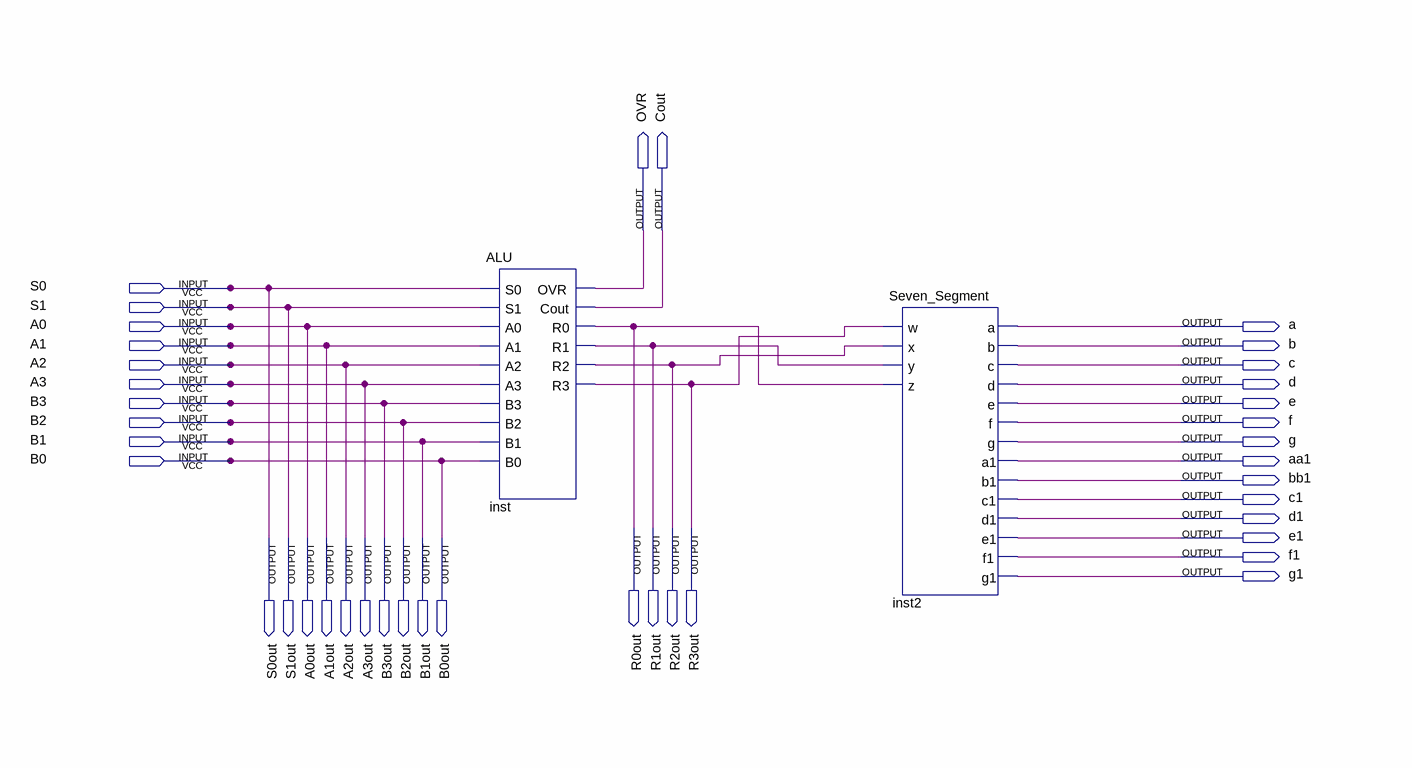
[diagram p0: schematic sheet]
// Quartus schematic Lab7_ALU.bdf as structural Verilog: 2 symbols, 40 pins
module Lab7_ALU (
  input  S0,
  input  S1,
  input  A0,
  input  A1,
  input  A2,
  input  A3,
  input  B3,
  input  B2,
  input  B1,
  input  B0,
  output OVR,
  output Cout,
  output a,
  output b,
  output c,
  output d,
  output e,
  output f,
  output g,
  output aa1,
  output bb1,
  output c1,
  output d1,
  output R0out,
  output R1out,
  output R2out,
  output R3out,
  output S0out,
  output S1out,
  output A0out,
  output A1out,
  output A2out,
  output A3out,
  output B3out,
  output B2out,
  output B1out,
  output B0out,
  output e1,
  output f1,
  output g1
);

  ALU inst (
    .S0(S0), .S1(S1), .A0(A0), .A1(A1), .A2(A2), .A3(A3), .B3(B3), .B2(B2), .B1(B1), .B0(B0), .OVR(OVR),
    .Cout(Cout), .R0(R0out), .R1(R1out), .R2(R2out), .R3(R3out));
  Seven_Segment inst2 (
    .w(R3out), .x(R2out), .y(R1out), .z(R0out), .a(a), .b(b), .c(c), .d(d), .e(e), .f(f), .g(g), .a1(aa1),
    .b1(bb1), .c1(c1), .d1(d1), .e1(e1), .f1(f1), .g1(g1));

  assign A0out = A0;
  assign A1out = A1;
  assign A2out = A2;
  assign A3out = A3;
  assign B0out = B0;
  assign B1out = B1;
  assign B2out = B2;
  assign B3out = B3;
  assign S0out = S0;
  assign S1out = S1;
endmodule
